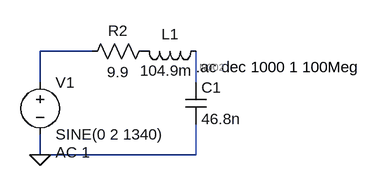
[diagram p0: schematic RLC.asc]
RLC.asc, the LTspice schematic file:
Version 4.1
SHEET 1 880 680
WIRE 208 -32 128 -32
WIRE 128 16 128 -32
WIRE 368 16 368 -32
WIRE 128 128 128 96
WIRE 368 128 368 80
WIRE 368 128 128 128
FLAG 128 128 0
SYMBOL voltage 128 0 R0
WINDOW 123 24 124 Left 2
WINDOW 39 0 0 Left 0
SYMATTR Value2 AC 1
SYMATTR InstName V1
SYMATTR Value SINE(0 2 1340)
SYMBOL res 304 -48 R90
WINDOW 0 0 56 VBottom 2
WINDOW 3 32 56 VTop 2
SYMATTR InstName R2
SYMATTR Value 9.9
SYMBOL cap 352 16 R0
SYMATTR InstName C1
SYMATTR Value 46.8n
SYMBOL ind 384 -48 R90
WINDOW 0 5 56 VBottom 2
WINDOW 3 30 62 VTop 2
SYMATTR InstName L1
SYMATTR Value 104.9m
TEXT 368 -8 Left 2 !.ac dec 1000 1 100Meg

The netlist it stands for:
* RLC.asc
V1 N001 0 SINE(0 2 1340) AC 1
R2 P001 N001 9.9
C1 N002 0 46.8n
L1 N002 P001 104.9m
.ac dec 1000 1 100Meg
.backanno
.end

* Results of the author's LTspice run, read from the files saved beside the schematic
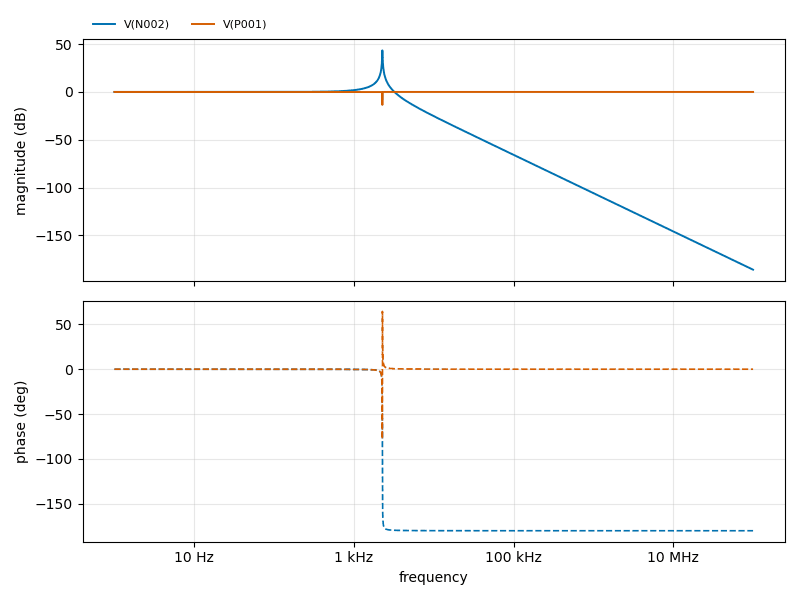
[diagram p1: AC Analysis of RLC.asc, plotted from the saved traces]
* AC Analysis, 1 run:
*   V(N002): 0.00 dB at 1 Hz, -185.75 dB at 100 MHz, peak 43.40 dB at 2.27 kHz, 3 dB below the peak at 2.264 kHz and 2.279 kHz
*   V(P001): -0.00 dB at 1 Hz, -0.00 dB at 100 MHz, peak -0.00 dB at 99.77 MHz, 3 dB below the peak at 2.28 kHz